# EAGLE design untitled (EAGLE 6.5.0)
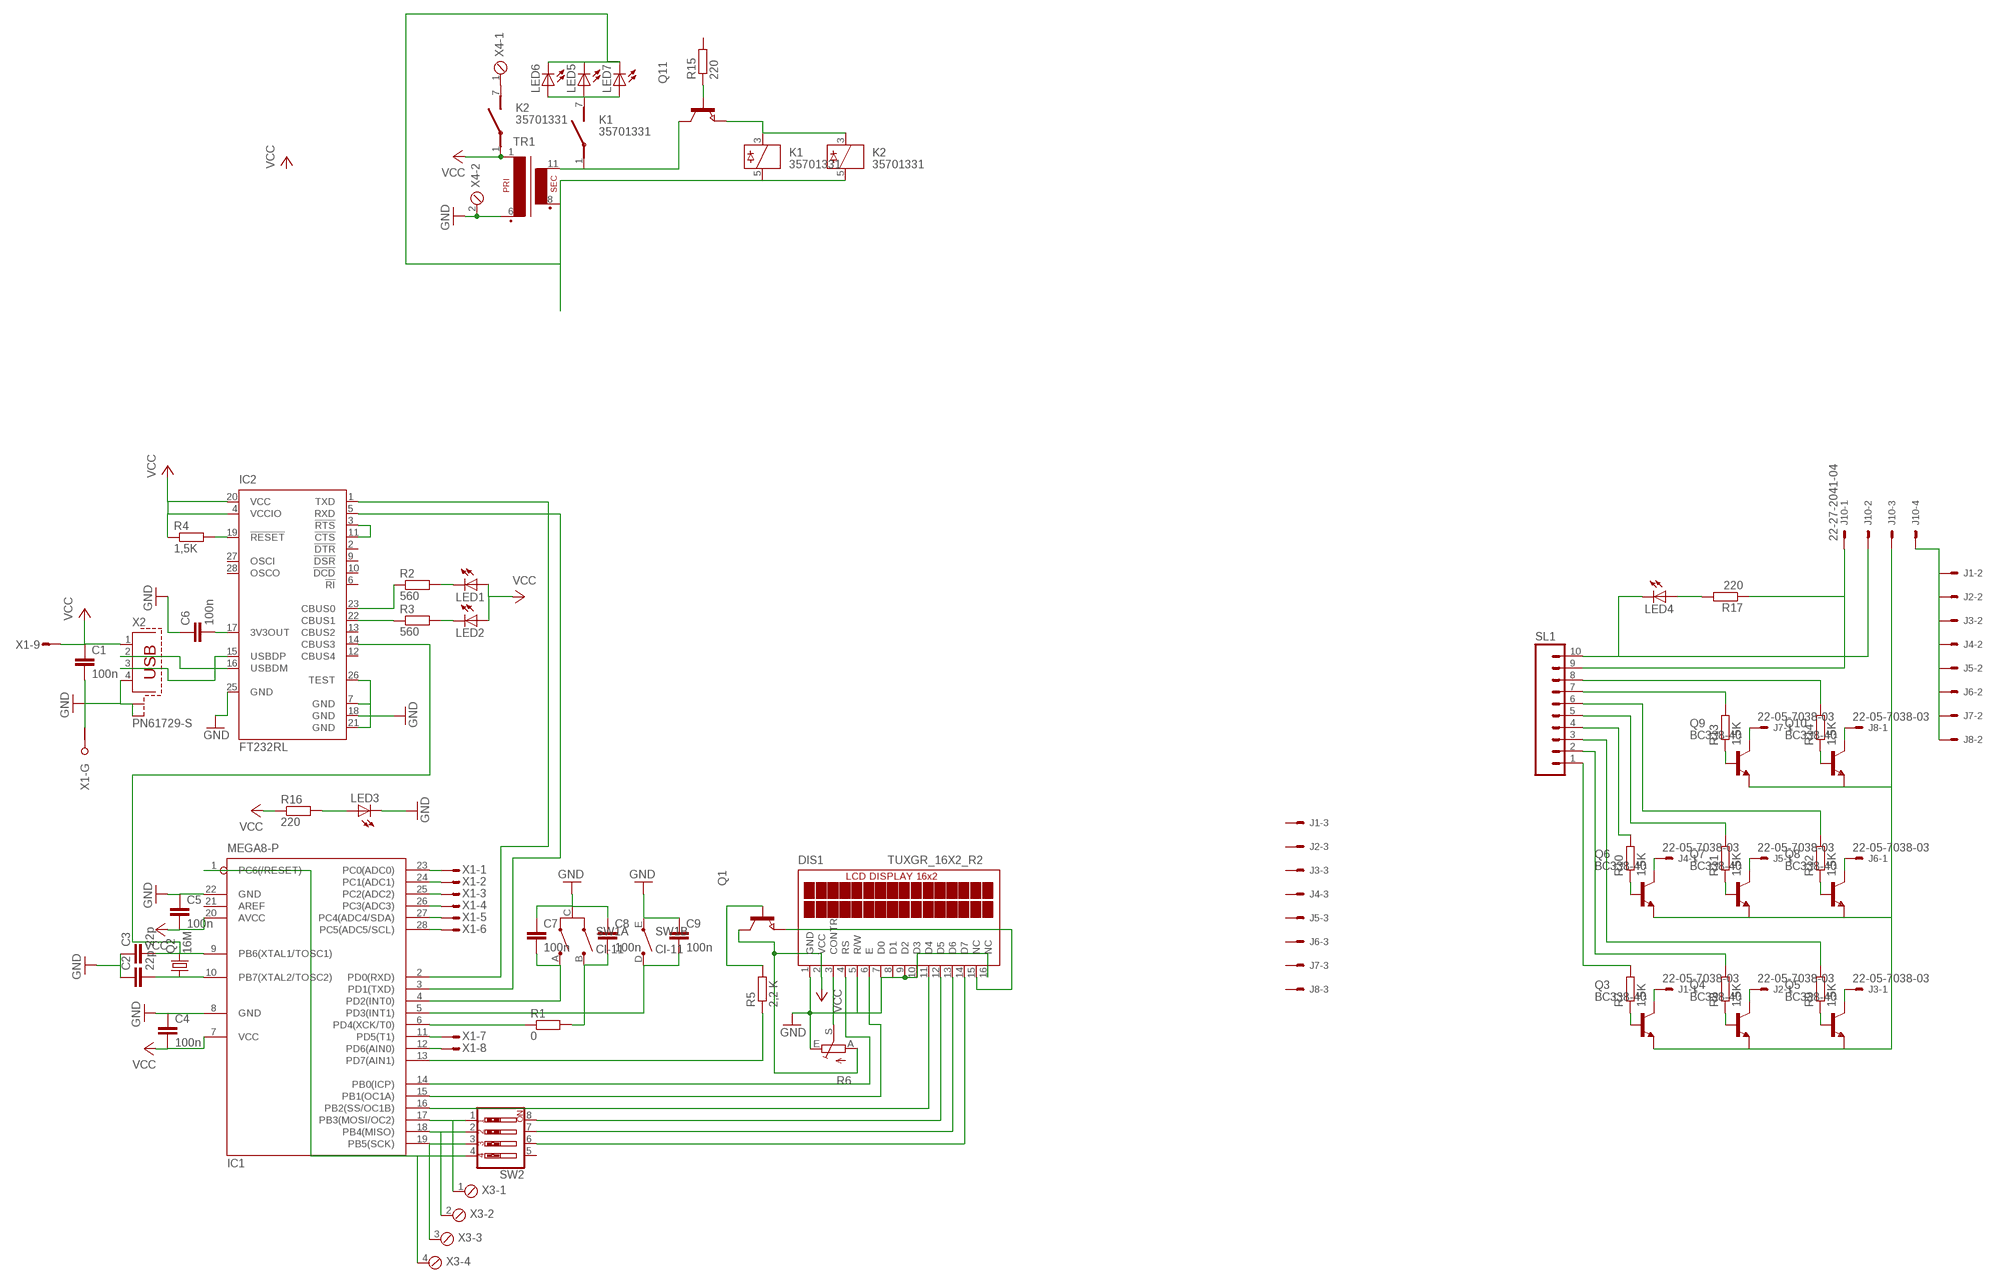
[diagram p0: schematic, sheet 1]

## Parts
C1  100n  C-EUC0603  [C0603]
C2  22p  C-EU050-024X044  [C050-024X044]
C3  22p  C-EU050-024X044  [C050-024X044]
C4  100n  C-EUC0603  [C0603]
C5  100n  C-EUC0603  [C0603]
C6  100n  C-EUC0603  [C0603]
C7  100n  C-EU050-024X044  [C050-024X044]
C8  100n  C-EU050-024X044  [C050-024X044]
C9  100n  C-EU050-024X044  [C050-024X044]
DIS1  TUXGR_16X2_R2  [TUXGR_16X2_R2]
IC1  MEGA8-P  [DIL28-3]
IC2  FT232RL  [SSOP28]
J1  22-05-7038-03  [7395-03]
J2  22-05-7038-03  [7395-03]
J3  22-05-7038-03  [7395-03]
J4  22-05-7038-03  [7395-03]
J5  22-05-7038-03  [7395-03]
J6  22-05-7038-03  [7395-03]
J7  22-05-7038-03  [7395-03]
J8  22-05-7038-03  [7395-03]
J10  22-27-2041-04  [6410-04]
K1  35701331  [REED]
K2  35701331  [REED]
LED1  LEDCHIPLED_0805  [CHIPLED_0805]
LED2  LEDCHIPLED_0805  [CHIPLED_0805]
LED3  LED5MM  [LED5MM]
LED4  LED5MM  [LED5MM]
LED5  LED5MM  [LED5MM]
LED6  LED5MM  [LED5MM]
LED7  LED5MM  [LED5MM]
Q1  NPN-TRANSISTOR_SOT23  [SOT23]
Q2  16M  CRYSTALHC49U-V  [HC49U-V]
Q3  BC338-40  [TO92-EBC]
Q4  BC338-40  [TO92-EBC]
Q5  BC338-40  [TO92-EBC]
Q6  BC338-40  [TO92-EBC]
Q7  BC338-40  [TO92-EBC]
Q8  BC338-40  [TO92-EBC]
Q9  BC338-40  [TO92-EBC]
Q10  BC338-40  [TO92-EBC]
Q11  NPN-TRANSISTOR_SOT23  [SOT23]
R1  0  R-EU_M1206  [M1206]
R2  560  R-EU_M1406  [M1406]
R3  560  R-EU_M1406  [M1406]
R4  1,5K  R-EU_0204/5  [0204/5]
R5  2,2 K  R-EU_0204/7  [0204/7]
R6  TRIM_EU-CA6V  [CA6V]
R7  1,5K  R-EU_0204/5  [0204/5]
R8  1,5K  R-EU_0204/5  [0204/5]
R9  1,5K  R-EU_0204/5  [0204/5]
R10  1,5K  R-EU_0204/5  [0204/5]
R11  1,5K  R-EU_0204/5  [0204/5]
R12  1,5K  R-EU_0204/5  [0204/5]
R13  1,5K  R-EU_0204/5  [0204/5]
R14  1,5K  R-EU_0204/5  [0204/5]
R15  220  R-EU_0204/7  [0204/7]
R16  220  R-EU_0204/7  [0204/7]
R17  220  R-EU_0204/7  [0204/7]
SL1  M10  [10P]
SW1  CI-11  [CI-11]
SW2  SW_DIP-4  [EDG-04]
TR1  EI48-1  [EI48-1]
X1  M09VPS  [M09VP]
X2  PN61729-S  [PN61729-S]
X3  MPT4  [4POL254]
X4  MPT4  [4POL254]

## Nets
GND: C1.2 C2.1 C3.1 C4.1 C5.1 C6.1 C7.1 C8.1 C9.1 DIS1.1(GND) DIS1.5(R/W) DIS1.7(D0) DIS1.8(D1) DIS1.9(D2) DIS1.10(D3) DIS1.16(NC) IC1.8(GND) IC1.22(GND) IC2.7(GND) IC2.18(GND) IC2.21(GND) IC2.25(GND) IC2.26(TEST) LED3.K(C) R6.E SW1.C(A:C) SW1.E(B:E) TR1.6(P2) X1.G1(-G:G1) X2.4 X2.S1 X2.S2 X4.2
N$2: IC1.11(PD5(T1)) X1.7(-7:M)
N$3: IC1.6(PD4(XCK/T0)) R1.1
N$4: LED5.K(C) LED6.K(C) LED7.K(C)
N$5: Q11.1(B) R15.1
N$6: K1.1(2:P) Q11.3(C) TR1.11(S4)
N$7: K1.3 K2.3 Q11.2(E)
N$8: K1.5 K2.5 TR1.8(S3)
N$11: IC2.16(USBDM) X2.2
N$12: IC2.15(USBDP) X2.3
N$13: DIS1.3(CONTR) R6.S
N$14: DIS1.4(RS) IC1.14(PB0(ICP))
N$15: DIS1.6(E) IC1.15(PB1(OC1A))
N$16: DIS1.11(D4) IC1.16(PB2(SS/OC1B))
N$17: DIS1.12(D5) SW2.8
N$18: DIS1.13(D6) SW2.7
N$19: DIS1.14(D7) SW2.6
N$20: IC1.13(PD7(AIN1)) R5.1
N$21: Q1.1(B) R5.2
N$22: DIS1.15(NC) Q1.2(E)
N$23: C3.2 IC1.9(PB6(XTAL1/TOSC1)) IC2.14(CBUS3) Q2.2
N$24: C6.2 IC2.17(3V3OUT)
N$25: C2.2 IC1.10(PB7(XTAL2/TOSC2)) Q2.1
N$26: LED1.C R2.2
N$27: LED2.C R3.2
N$28: IC2.19(!RESET) R4.2
N$29: IC2.23(CBUS0) R2.1
N$30: IC2.22(CBUS1) R3.1
N$31: IC2.3(!RTS) IC2.11(!CTS)
N$32: IC1.2(PD0(RXD)) IC2.1(TXD)
N$33: IC1.3(PD1(TXD)) IC2.5(RXD)
N$34: IC1.1(PC6(/RESET)) SW2.4 X3.4
N$35: IC1.23(PC0(ADC0)) X1.1(-1:M)
N$36: IC1.24(PC1(ADC1)) X1.2(-2:M)
N$37: IC1.25(PC2(ADC2)) X1.3(-3:M)
N$38: IC1.26(PC3(ADC3)) X1.4(-4:M)
N$39: IC1.27(PC4(ADC4/SDA)) X1.5(-5:M)
N$40: IC1.28(PC5(ADC5/SCL)) X1.6(-6:M)
N$41: IC1.12(PD6(AIN0)) X1.8(-8:M)
N$42: IC1.17(PB3(MOSI/OC2)) SW2.1 X3.1
N$43: IC1.18(PB4(MISO)) SW2.2 X3.2
N$44: IC1.19(PB5(SCK)) SW2.3 X3.3
N$45: K1.7(2:S) LED5.A LED6.A LED7.A
N$46: C9.2 IC1.5(PD3(INT1)) SW1.D(B:D)
N$47: C7.2 IC1.4(PD2(INT0)) SW1.A(A:A)
N$48: C8.2 R1.2 SW1.B(A:B)
N$49: J1.1 Q3.C
N$50: J2.1 Q4.C
N$51: K2.7(2:S) X4.1
N$52: LED3.A R16.2
N$53: J10.1 R17.1 SL1.9
N$54: LED4.A R17.2
N$55: J10.2 LED4.K(C) SL1.10
N$56: J3.1 Q5.C
N$57: J6.1 Q8.C
N$58: J5.1 Q7.C
N$59: J4.1 Q6.C
N$60: J7.1 Q9.C
N$61: J8.1 Q10.C
N$62: R7.2 SL1.1
N$63: Q3.B R7.1
N$64: R8.2 SL1.2
N$65: Q4.B R8.1
N$66: R9.2 SL1.3
N$70: R10.2 SL1.4
N$71: R11.2 SL1.5
N$72: R12.2 SL1.6
N$73: R13.2 SL1.7
N$74: R14.2 SL1.8
N$75: Q9.B R13.1
N$76: Q10.B R14.1
N$77: Q8.B R12.1
N$78: Q7.B R11.1
N$79: Q6.B R10.1
N$80: Q5.B R9.1
N$81: J1.2 J2.2 J3.2 J4.2 J5.2 J6.2 J7.2 J8.2 J10.4
N$82: J10.3 Q3.E Q4.E Q5.E Q6.E Q7.E Q8.E Q9.E Q10.E
VCC: C1.1 C4.2 C5.2 DIS1.2(VCC) IC1.7(VCC) IC1.20(AVCC) IC2.4(VCCIO) IC2.20(VCC) K2.1(2:P) LED1.A LED2.A Q1.3(C) R4.1 R6.A R16.1 TR1.1 X1.9(-9:M) X2.1
Unconnected: IC1.21(AREF) IC2.2(!DTR) IC2.6(!RI) IC2.9(!DSR) IC2.10(!DCD) IC2.12(CBUS4) IC2.13(CBUS2) IC2.27(OSCI) IC2.28(OSCO) J1.3 J2.3 J3.3 J4.3 J5.3 J6.3 J7.3 J8.3 R15.2 SW2.5 X1.G2(-G:G2) X4.3 X4.4

## Library data of the parts
C1-C9 = rcl:C-EU: CAPACITOR, European symbol
DIS1 = display-lcd:TUXGR_16X2_R2: Tuxgraphics LCD display 16x2 characters reflective, without background light Source: tuxgr_12x2_r2.pdf; OC_FARNELL: unknown; OC_NEWARK: unknown
IC1 = atmel:MEGA8-P: MICROCONTROLLER 8 Kbytes FLASH, 1 kbytes SRAM, 512 bytes EEPROM, USART, 4-channel 10 bit ADC, 2-channel 8 bit ADC Pin compatible with Atmega48, ATMega88, ATMega168 Source: avr.lbr; OC_FARNELL: unknown; OC_NEWARK: unknown
IC2 = ftdichip:FT232R: Source: http://www.ftdichip.com/Documents/DataSheets/DS_FT232R_v104.pdf; MPN: FT232RL; OC_FARNELL: 1146032; OC_NEWARK: 91K9918
J1-J8 = con-molex:22-?-03: CONNECTOR wire to board 2.54 mm (.1 inch) pitch header; OC_FARNELL: unknown; OC_NEWARK: unknown
J10 = con-molex:22-?-04: CONNECTOR wire to board 2.54 mm (.1 inch) pitch header; OC_FARNELL: unknown; OC_NEWARK: unknown
K1 K2 = relay:35701331: RELAY reed, 1 x norm. open with polarity; OC_FARNELL: unknown; OC_NEWARK: unknown
LED1-LED7 = led:LED: LED OSRAM: - CHIPLED LG R971, LG N971, LY N971, LG Q971, LY Q971, LO R971, LY R971 LH N974, LH R974 LS Q976, LO Q976, LY Q976 LO Q996 - Hyper CHIPLED LW Q18S LB Q993, LB Q99A, LB R99A - SideLED LS A670, LO A670, LY A670, LG A670, LP A670 LB A673, LV A673, LT A673, LW A673 LH A674 LY A675 LS A676, LA A676, LO A676, LY A676, LW A676 LS A679, LY A679, LG A679 - Hyper Micro SIDELED® LS Y876, LA Y876, LO Y876, LY Y876 LT Y87S - SmartLED LW L88C, LW L88S LB L89C, LB L89S, LG L890 LS L89K, LO L89K, LY L89K LS L896, LA L896, LO L896, LY L896 - TOPLED LS T670, LO T670, LY T670, LG T670, LP T670 LSG T670, LSP T670, LSY T670, LOP T670, LYG T670 LG T671, LOG T671, LSG T671 LB T673, LV T673, LT T673, LW T673 LH T674 LS T676, LA T676, LO T676, LY T676, LB T676, LH T676, LSB T676, LW T676 LB T67C, LV T67C, LT T67C, LS T67K, LO T67K, LY T67K, LW E67C LS E67B, LA E67B, LO E67B, LY E67B, LB E67C, LV E67C, LT E67C LW T67C LS T679, LY T679, LG T679 LS T770, LO T770, LY T770, LG T770, LP T770 LB T773, LV T773, LT T773, LW T773 LH T774 LS E675, LA E675, LY E675, LS T675 LS T776, LA T776, LO T776, LY T776, LB T776 LHGB T686 LT T68C, LB T68C - Hyper Mini TOPLED® LB M676 - Mini TOPLED Santana® LG M470 LS M47K, LO M47K, LY M47K Source: http://www.osram.convergy.de LUXEON: - LUMILED® LXK2-PW12-R00, LXK2-PW12-S00, LXK2-PW14-U00, LXK2-PW14-V00 LXK2-PM12-R00, LXK2-PM12-S00, LXK2-PM14-U00 LXK2-PE12-Q00, LXK2-PE12-R00, LXK2-PE12-S00, LXK2-PE14-T00, LXK2-PE14-U00 LXK2-PB12-K00, LXK2-PB12-L00, LXK2-PB12-M00, LXK2-PB14-N00, LXK2-PB14-P00, LXK2-PB14-Q00 LXK2-PR12-L00, LXK2-PR12-M00, LXK2-PR14-Q00, LXK2-PR14-R00 LXK2-PD12-Q00, LXK2-PD12-R00, LXK2-PD12-S00 LXK2-PH12-R00, LXK2-PH12-S00 LXK2-PL12-P00, LXK2-PL12-Q00, LXK2-PL12-R00 Source: www.luxeon.com KINGBRIGHT: KA-3528ASYC Source: www.kingbright.com
Q1 Q11 = semicon-smd-ipc:NPN-TRANSISTOR_: NPN TRANSISTOR
Q2 = crystal:CRYSTAL: CRYSTAL; OC_FARNELL: 1666969; OC_NEWARK: unknown
Q3-Q10 = transistor-npn:BC338*: NPN Transistor
R1-R5 R7-R17 = resistor:R-EU_: RESISTOR, European symbol
R6 = pot:TRIM_EU-: POTENTIOMETER
SL1 = con-amp-quick:M10: AMP QUICK CONNECTOR; OC_FARNELL: unknown; OC_NEWARK: unknown
SW1 = piher:CI-11: 11mm Incemental Encoder Source: www.piher.net .. 04-CI-11v04.pdf; OC_FARNELL: unknown; OC_NEWARK: unknown
SW2 = special:SW_DIP-4: DIP SWITCH
TR1 = trafo:EI48-1: TRANSFORMER 1 primary winding, 1 secondary winding ERA
X1 = con-subd:M09VPS: SUB-D; OC_FARNELL: unknown; OC_NEWARK: unknown
X2 = con-berg:PN61729-S: BERG USB connector; OC_FARNELL: unknown; OC_NEWARK: unknown
X3 X4 = con-phoenix-254:MPT4: PHOENIX CONNECTOR; OC_FARNELL: unknown; OC_NEWARK: unknown

## Board
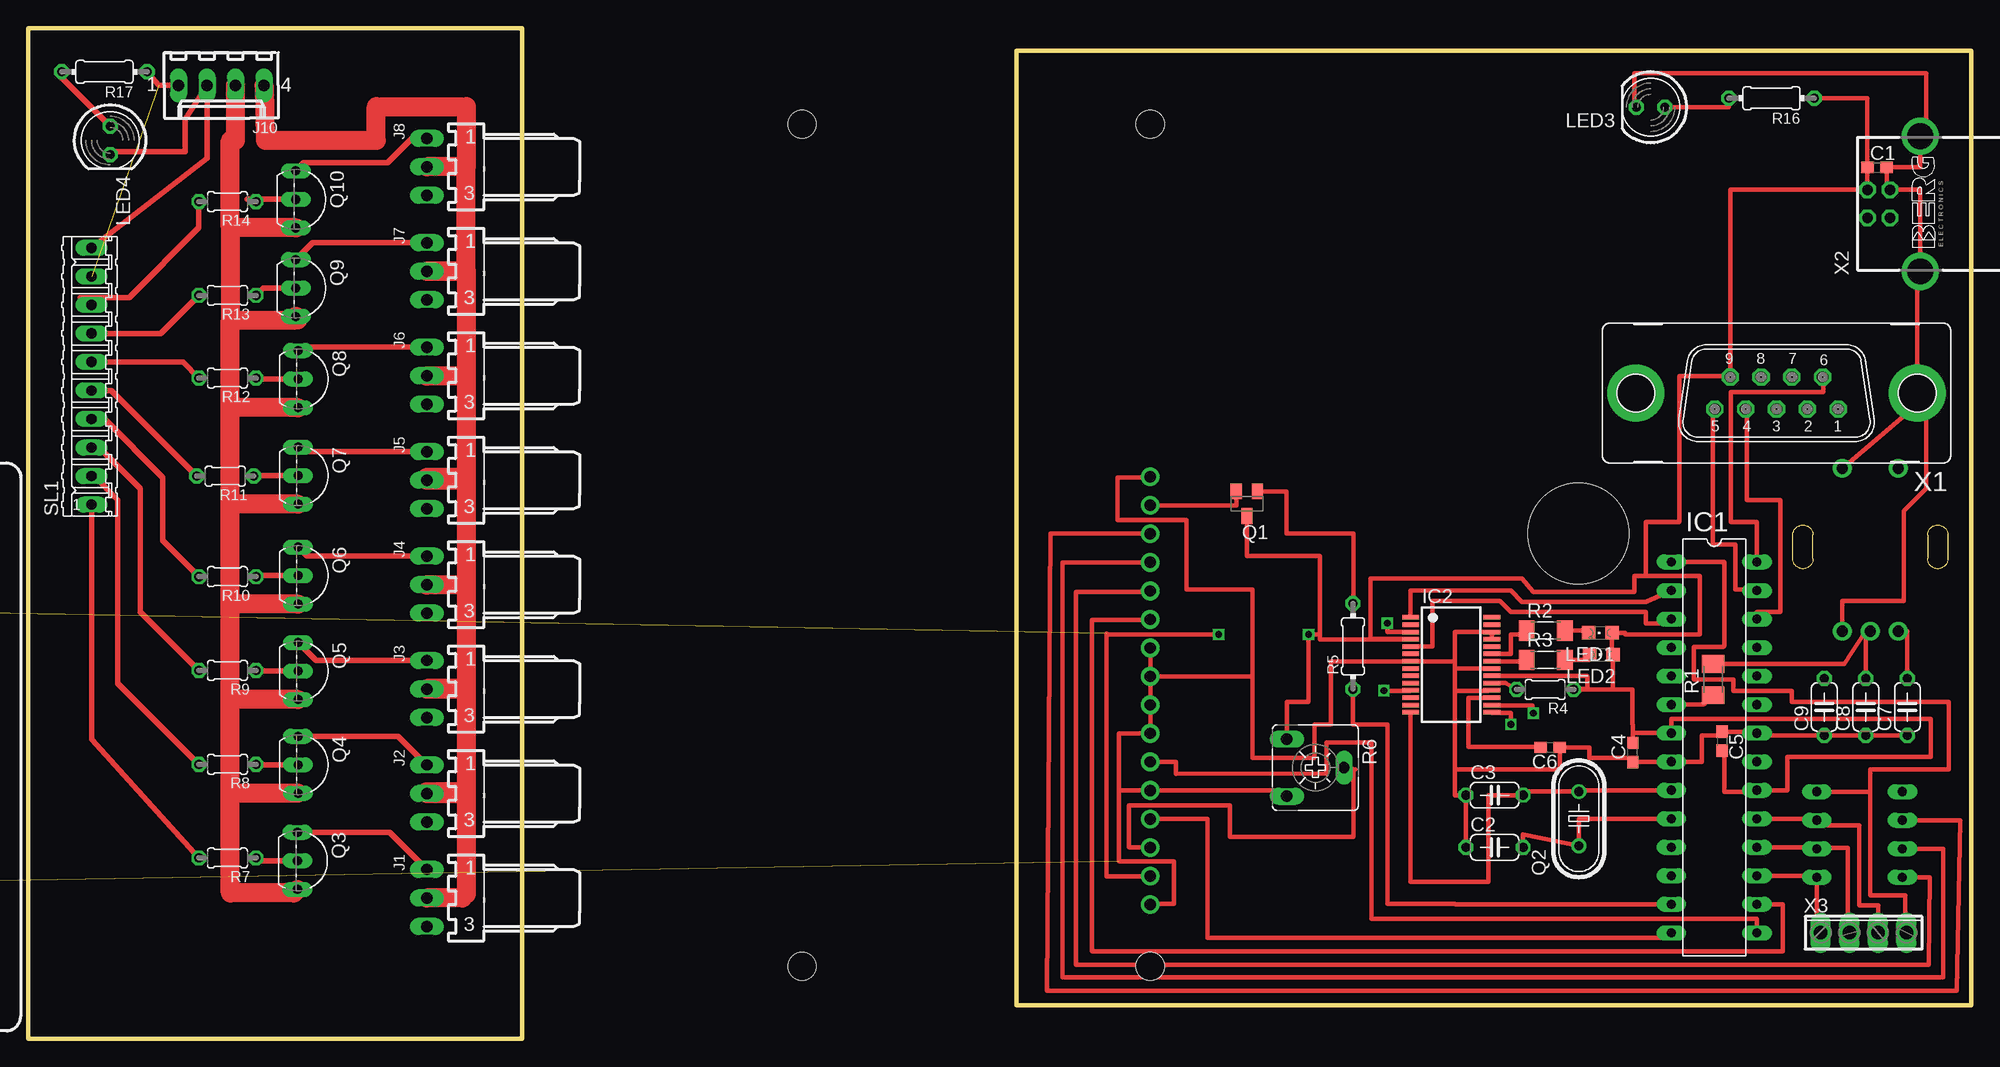
[diagram p1: board, top side]
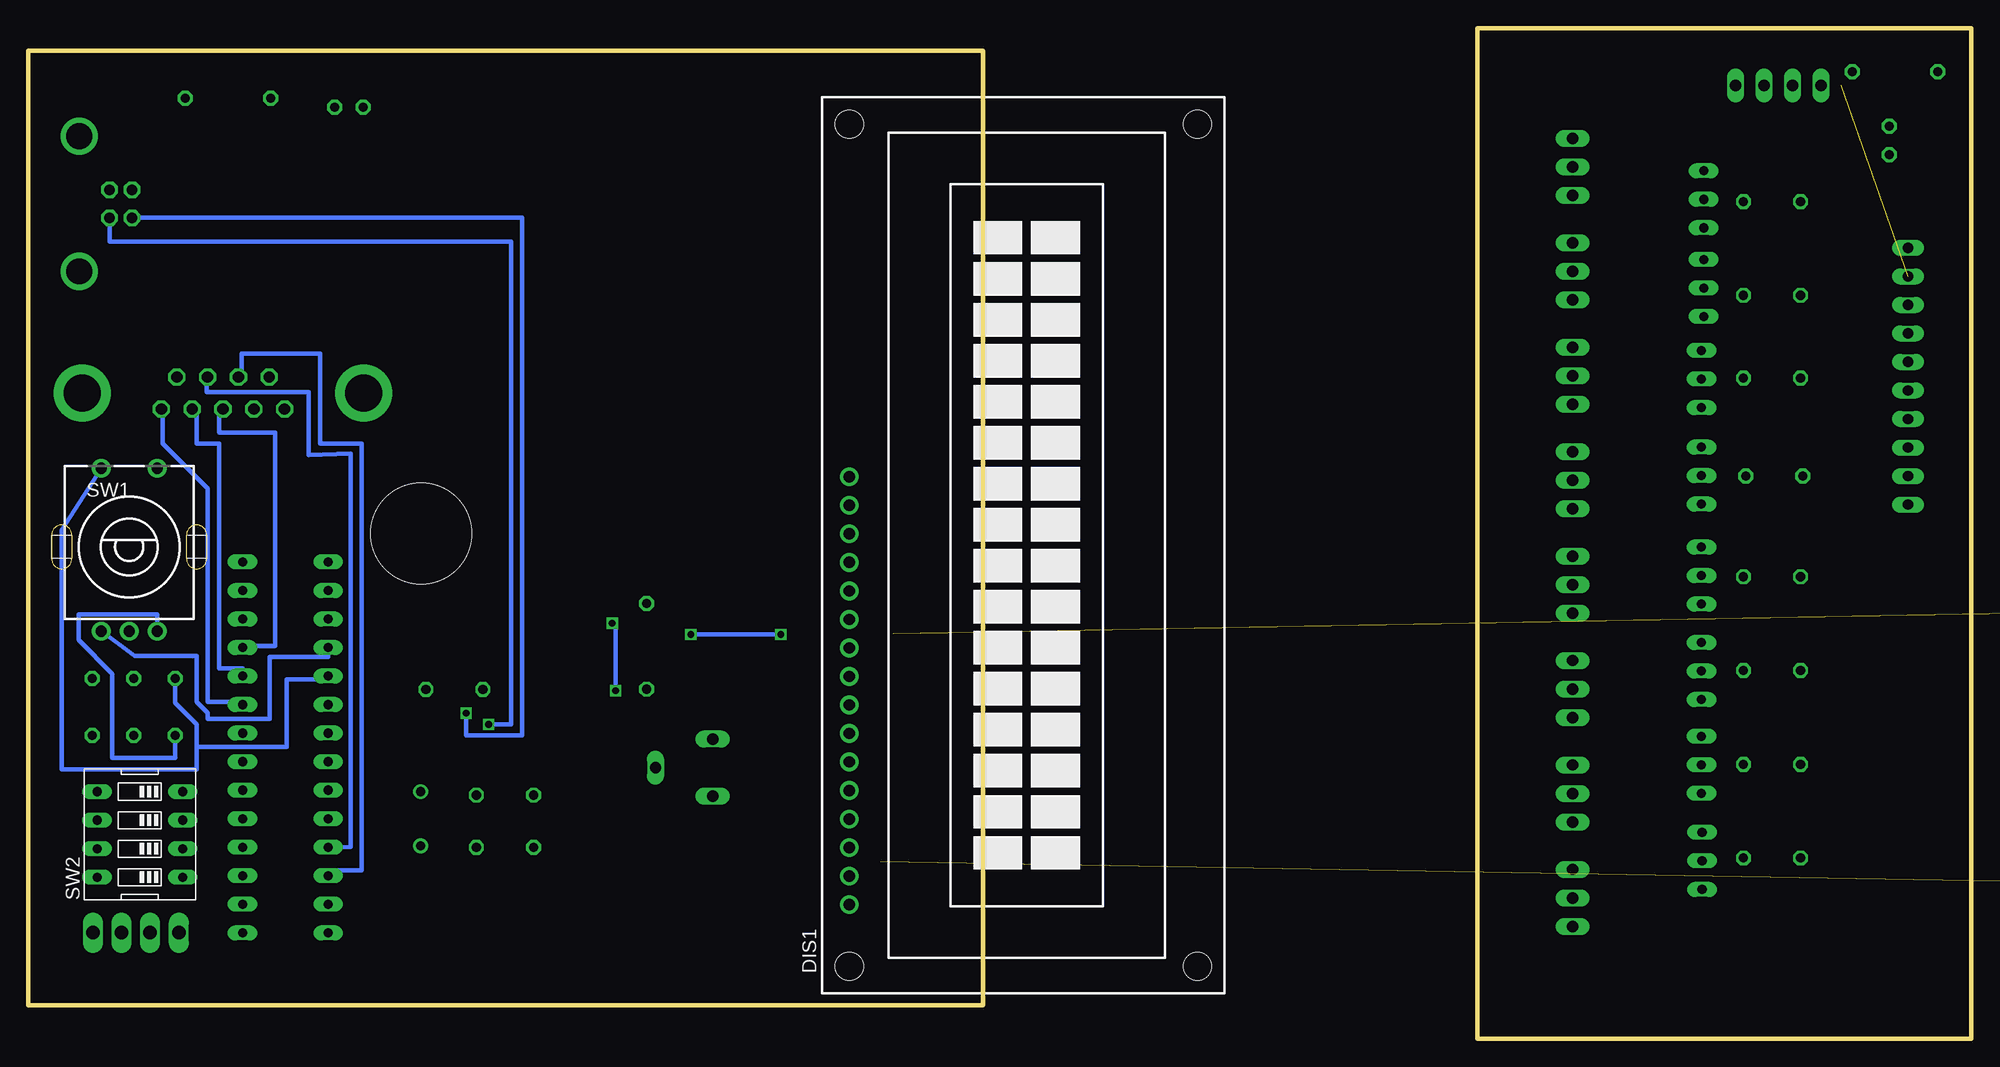
[diagram p2: board, bottom side, seen from below]

Size 173 x 90 mm. Coordinates in mm from the lower left corner, seen from the top.
Outline: 88,88 173,88 173,3 88,3 88,88
Outline: 0,90 44,90 44,0 0,0 0,90
Copper layers (1*16): Top 0.035mm / dielectric 1.5mm / Bottom 0.035mm
Design rules "default": minimum track width 10mil, minimum drill 24mil, track to track 8mil, track to pad 8mil, pad to pad 8mil, via to via 8mil, smd to smd 8mil, copper to edge 40mil, drill to drill 8mil, minimum pad ring 10mil, minimum via ring 8mil, stop-mask expansion 4mil, vias tented up to drill 0mil, thermal gap 10mil
Holes 9 mm at 138,45

### Footprints (pad centres in the part's own frame; a part is rotated, then mirrored left to right if it is on the bottom)
C0603 = smd 1.1 x 1: 1 -0.85,0; 2 0.85,0
C050-024X044 = drill 0.813 octagon: 1 -2.54,0; 2 2.54,0
TUXGR_16X2_R2 = drill 1 pad 1.676: 1 -32,15.5; 2 -29.46,15.5; 3 -26.92,15.5; 4 -24.38,15.5; 5 -21.84,15.5; 6 -19.3,15.5; 7 -16.76,15.5; 8 -14.22,15.5; 9 -11.68,15.5; 10 -9.14,15.5; 11 -6.6,15.5; 12 -4.06,15.5; 13 -1.52,15.5; 14 1.02,15.5; 15 3.56,15.5; 16 6.1,15.5 | hole 2.5: -37.5,-15.5; 37.5,-15.5; -37.5,15.5; 37.5,15.5
DIL28-3 = drill 0.813 long: 1 -16.51,-3.81; 2 -13.97,-3.81; 3 -11.43,-3.81; 4 -8.89,-3.81; 5 -6.35,-3.81; 6 -3.81,-3.81; 7 -1.27,-3.81; 8 1.27,-3.81; 9 3.81,-3.81; 10 6.35,-3.81; 11 8.89,-3.81; 12 11.43,-3.81; 13 13.97,-3.81; 14 16.51,-3.81; 15 16.51,3.81; 16 13.97,3.81; 17 11.43,3.81; 18 8.89,3.81; 19 6.35,3.81; 20 3.81,3.81; 21 1.27,3.81; 22 -1.27,3.81; 23 -3.81,3.81; 24 -6.35,3.81; 25 -8.89,3.81; 26 -11.43,3.81; 27 -13.97,3.81; 28 -16.51,3.81
SSOP28 = smd 0.4 x 1.5: 1 -4.225,-3.625; 2 -3.575,-3.625; 3 -2.925,-3.625; 4 -2.275,-3.625; 5 -1.625,-3.625; 6 -0.975,-3.625; 7 -0.325,-3.625; 8 0.325,-3.625; 9 0.975,-3.625; 10 1.625,-3.625; 11 2.275,-3.625; 12 2.925,-3.625; 13 3.575,-3.625; 14 4.225,-3.625; 15 4.225,3.625; 16 3.575,3.625; 17 2.925,3.625; 18 2.275,3.625; 19 1.625,3.625; 20 0.975,3.625; 21 0.325,3.625; 22 -0.325,3.625; 23 -0.975,3.625; 24 -1.625,3.625; 25 -2.275,3.625; 26 -2.925,3.625; 27 -3.575,3.625; 28 -4.225,3.625
7395-03 = drill 1.016 long: 1 2.54,0; 2 0,0; 3 -2.54,0
6410-04 = drill 1.016 long: 1 3.81,0; 2 1.27,0; 3 -1.27,0; 4 -3.81,0
REED = drill 0.813 long: 1 -17.78,2.54; 3 -12.7,2.54; 5 -7.62,2.54; 7 -2.54,2.54
CHIPLED_0805 = smd 1.2 x 1.2: A 0,-1.05; C 0,1.05
LED5MM = drill 0.813 octagon: A -1.27,0; K 1.27,0
SOT23 = smd 1 x 1.4: 1 -0.95,-1.1; 2 0.95,-1.1; 3 0,1.1
HC49U-V = drill 0.813: 1 -2.413,0; 2 2.413,0
TO92-EBC = drill 0.813 long: B 0,-1.27; C -2.54,-1.27; E 2.54,-1.27
M1206 = smd 1.6 x 2: 1 -1.4,0; 2 1.4,0
M1406 = smd 1.4 x 1.8: 1 -1.7,0; 2 1.7,0
0204/5 = drill 0.813 octagon: 1 -2.54,0; 2 2.54,0
0204/7 = drill 0.813 octagon: 1 -3.81,0; 2 3.81,0
CA6V = drill 1.016 long: A -2.54,-2.54; E 2.54,-2.54; S 0,2.54
10P = drill 0.914 long: 1 -11.43,0; 2 -8.89,0; 3 -6.35,0; 4 -3.81,0; 5 -1.27,0; 6 1.27,0; 7 3.81,0; 8 6.35,0; 9 8.89,0; 10 11.43,0
CI-11 = drill 1 pad 1.676: A -2.5,-7.5; B 0,-7.5; C 2.5,-7.5; D -2.5,7; E 2.5,7
EDG-04 = drill 0.813 long: 1 -3.81,-3.81; 2 -1.27,-3.81; 3 1.27,-3.81; 4 3.81,-3.81; 5 3.81,3.81; 6 1.27,3.81; 7 -1.27,3.81; 8 -3.81,3.81
EI48-1 = drill 1.194 pad 5.08 octagon: 1 -13.767,12.497; 6 -13.767,-12.497 | drill 1.194 pad 3.81 octagon: 7 13.767,-12.497; 8 13.767,-7.493; 11 13.767,7.493; 12 13.767,12.497
M09VP = drill 1.016 octagon: 1 -5.486,1.422; 2 -2.743,1.422; 3 0,1.422; 4 2.743,1.422; 5 5.486,1.422; 6 -4.115,-1.422; 7 -1.372,-1.422; 8 1.372,-1.422; 9 4.115,-1.422 | drill 3.302 pad 5.08: G1 -12.522,0; G2 12.522,0
PN61729-S = drill 0.95 octagon: 1 1.25,4.71; 2 -1.25,4.71; 3 -1.25,2.71; 4 1.25,2.71 | drill 2.3 pad 2.9: S1 -6.02,0; S2 6.02,0
4POL254 = drill 1.2 long: 1 -3.81,0; 2 -1.27,0; 3 1.27,0; 4 3.81,0

### Placement (x,y rotation side)
C1  164.6,77.6 0 top
C2  130.55,17.05 0 top
C3  130.55,21.7 0 top
C4  142.85,25.5 90 top
C5  150.8,26.5 270 top
C6  135.5,25.95 180 top
C7  167.3,29.55 90 top
C8  163.6,29.55 90 top
C9  159.9,29.55 90 top
DIS1  84.4,43.95 90 bottom
IC1  150.1,25.95 270 top
IC2  126.7,33.3 270 top
J1  35.5,12.55 90 top
J2  35.5,21.85 90 top
J3  35.5,31.15 90 top
J4  35.5,40.45 90 top
J5  35.5,49.75 90 top
J6  35.5,59.05 90 top
J7  35.5,68.35 90 top
J8  35.5,77.65 90 top
J10  17.2,84.9 180 top
K1  -23,-8 0 top  (outside the outline)
K2  -23,-17 0 top  (outside the outline)
LED1  139.95,36.15 90 top
LED2  140.05,34.2 90 top
LED3  144.45,82.95 180 top
LED4  7.3,80 270 top
LED5  -41,-22 0 top  (outside the outline)
LED6  -41,-39 0 top  (outside the outline)
LED7  -41,-46 0 top  (outside the outline)
Q1  108.5,47.65 180 top
Q2  138.05,19.6 90 top
Q3  25.25,15.85 270 top
Q4  25.3,24.4 270 top
Q5  25.3,32.75 270 top
Q6  25.3,41.25 270 top
Q7  25.3,50.15 270 top
Q8  25.3,58.75 270 top
Q9  25.1,66.85 270 top
Q10  25.1,74.75 270 top
Q11  -42,-33 0 top  (outside the outline)
R1  150,32 90 top
R2  135.1,36.35 0 top
R3  135.1,33.75 0 top
R4  135.05,31.1 180 top
R5  117.95,34.95 90 top
R6  114.6,24.15 270 top
R7  17.75,16.1 180 top
R8  17.75,24.45 180 top
R9  17.75,32.8 180 top
R10  17.75,41.15 180 top
R11  17.55,50.1 180 top
R12  17.75,58.85 180 top
R13  17.75,66.2 180 top
R14  17.75,74.55 180 top
R15  -39,-28 0 top  (outside the outline)
R16  155.2,83.75 180 top
R17  6.8,86.1 180 top
SL1  5.65,59 90 top
SW1  164,43.8 0 bottom
SW2  163.05,18.2 90 bottom
TR1  -22,26 0 top  (outside the outline)
X1  155.65,57.5 180 top
X2  168.45,74.35 90 top
X3  163.4,9.45 0 top
X4  -38,-53 0 top  (outside the outline)

### Tracks (layer width: path | path; a pad name or v marks a point on that pad's centre or on a via)
GND  (2 unrouted)
  Top 0.406: 127,33.62 127,36.23 IC2.26 IC2.25 | 127,33 130.32,33 IC2.21 | 127,33 127,31 | 127,31 130,31 130,31.02 IC2.18 | 127,33 127,33.62 | 127,33.62 IC2.7 116,33.62 116,28 114.5,28 114.5,25 109,25 109,32.27 | DIS1.1 99.9,12 102,12 102,15.8 97.1,15.8 97.1,22.11 | 97.1,22.11 DIS1.5 113.06,22.11 R6.E | 97.1,22.11 97.1,27.19 DIS1.7 DIS1.8 DIS1.9 | DIS1.9 DIS1.10 | DIS1.16 99.9,50 97,50 97,46.2 103.1,46.2 103.1,40 109,40 109,32.27 | 109,32.27 DIS1.9 | C7.1 C8.1 C9.1 153.91,27.01 IC1.22 153.91,27.35 C5.1 150.8,27 149,27 149,24.68 IC1.8 146.29,24.65 C4.1 142.85,25 139,25 139,25.95 C6.1 136.35,24 127,24 | C2.1 C3.1 127,21.7 127,24 | 127,24 127,31 | LED3.K 143.18,83 143,83 143,86 169,86 169,80.37 X2.S2 168.45,77.6 C1.2 165.45,75.6 X2.4 168.45,75.6 X2.S1 168.17,68.33 X1.G1 168.17,57 | 168.17,57 168.17,56.47 SW1.E | SW1.C 161.5,39 167,39 167,47 169,49 169,57 168.17,57
  Bottom 0.406: C9.1 159.9,25 165.5,25 165.5,32.5 168.5,35.5 168.5,37.8 161.5,37.8 SW1.C
N$2
  Bottom 0.406: IC1.11 146.29,17 144.3,17.1 144.3,52.1 148,52 148,57.6 157.1,57.6 157.1,58.92 X1.7
N$3
  Top 0.406: R1.1 149.16,29.76 IC1.6
N$4  (2 unrouted)
N$5  (1 unrouted)
N$6  (2 unrouted)
N$7  (2 unrouted)
N$8  (2 unrouted)
N$11  (via drill 0.6)
  Top 0.406: IC2.16 130.32,29.7 133.9,29.7 133.9,29 v134,29
  Bottom 0.406: v134,29 134,27 129,27 129,73.1 X2.2
N$12  (via drill 0.6)
  Top 0.406: IC2.15 130.32,29 132,29 v132,28
  Bottom 0.406: v132,28 130,28 130,71 165.74,71 X2.3
N$13
  Top 0.406: R6.S 118.14,24 118,24 118,18 107,18 107,20.8 98,20.8 98,17.03 DIS1.3
N$14
  Top 0.406: IC1.14 145.85,9 105,9 105,19.57 DIS1.4
N$15
  Top 0.406: DIS1.6 102.2,24.65 102.2,23.6 115.6,23.65 | 115.6,23.65 115.6,23.6 | 115.6,23.65 115.6,26.4 119.6,26.4 119.6,10.7 153.9,10.7 153.91,9.49 IC1.15
N$16
  Top 0.406: DIS1.11 99.9,37.3 94.7,37.3 94.7,7.8 156.2,7.8 156.2,11.98 IC1.16
N$17
  Top 0.406: DIS1.12 99.9,39.8 93.3,39.8 93.3,6.6 169.2,6.6 169.3,14.39 SW2.8
N$18
  Top 0.406: DIS1.13 99.9,42.4 92.1,42.4 92.1,5.5 170.5,5.5 170.5,16.93 SW2.7
N$19
  Top 0.406: DIS1.14 99.9,45 91,45 90.7,4.3 171.7,4.3 172,19.47 SW2.6
N$20
  Top 0.406: R5.1 117.95,28 121,28 121,12 127,12 127,11.98 IC1.13
N$21
  Top 0.406: R5.2 118,39 118,45 112,45 112,48.75 Q1.1
N$22
  Top 0.406: Q1.2 107.55,47.51 DIS1.15
N$23
  Top 0.406: IC2.14 123.08,14 130,14 130,21.7 C3.2 133.09,22.01 Q2.2 138.05,22.14 IC1.9
N$24
  Top 0.406: C6.2 134.65,26 128.2,26 128.2,30.38 IC2.17
N$25
  Top 0.406: C2.2 133.09,18.19 Q2.1 138.05,19.6 IC1.10
N$26
  Top 0.406: LED1.C 138.9,36.35 R2.2
N$27
  Top 0.406: LED2.C 139,33.75 R3.2
N$28
  Top 0.406: R4.2 131.51,31.68 IC2.19
N$29
  Top 0.406: R2.1 133.4,36 132,36 132,34.27 IC2.23
N$30
  Top 0.406: R3.1 133.4,33.62 IC2.22
N$31  (via drill 0.6)
  Top 0.406: IC2.11 123.08,31 v120.7,31 | v121,37 121,36.23 IC2.3
  Bottom 0.406: v120.7,31 120.7,37 v121,37
N$32
  Top 0.406: IC2.1 123.08,39.92 132,39.92 133,38.9 144,38.9 IC1.2
N$33
  Top 0.406: IC1.3 146.29,37 144,37 144,38 132,38 131,39 125,39 125,34.92 IC2.5
N$34
  Top 0.406: 164,22 164,12.8 167.1,12.8 167.1,9.45 X3.4 | SW2.4 164,22 | 164,22 164,24 171,24 171,30 157,30 157,31 151.8,31 151.8,32 148.3,32 148.3,34.9 150.9,34.9 151,35 151,42.46 IC1.1
N$35
  Bottom 0.406: IC1.23 153.91,30 157,30 157,49 161,53 161,56.08 X1.1
N$36
  Bottom 0.406: IC1.24 153.91,33 156,33 156,53 158,53 158,56.08 X1.2
N$37
  Bottom 0.406: IC1.25 153.91,35 151,35 151,54 156,54 156,56.08 X1.3
N$38
  Top 0.406: IC1.26 153.91,38 156,38 156,48 153,48 153,56.08 X1.4
N$39
  Top 0.406: IC1.27 153.91,40 152,40 152,44 150,44 150,56.08 X1.5
N$40
  Top 0.406: IC1.28 153.91,46 151.6,46 151.6,57.6 159.8,57.6 159.8,58.92 X1.6
N$41
  Bottom 0.406: IC1.12 146.29,15 143.3,15 143.3,53 147,53 147,61 154,61 154,58.92 X1.8
N$42
  Top 0.406: X3.1 159.24,9.45 SW2.1 159.24,14.52 IC1.17
N$43
  Top 0.406: X3.2 162,9.45 162,17 159.24,17 SW2.2 159.24,17.06 IC1.18
N$44
  Top 0.406: X3.3 164.7,9.45 164.7,11.9 163,11.9 163,19 159.24,19 SW2.3 159.24,19.6 IC1.19
N$45  (3 unrouted)
N$46
  Bottom 0.406: IC1.5 146.29,32 150,32 150,26 158,26 | 158,26 158,28 159.9,29.9 C9.2 | SW1.D 170,45.3 170,24 158,24 158,26
N$47
  Top 0.406: C7.2 167.3,36.3 SW1.A
  Bottom 0.406: IC1.4 146.29,34 151.5,34 151.5,28.5 157,28.5 157,29 158,30 158,34.1 163.5,34.1 SW1.A | 167.4,32.09 C7.2
N$48
  Top 0.406: C8.2 163.6,36.3 | 163.6,36.3 SW1.B | 163.6,36.3 161.7,33.4 R1.2
N$49
  Top 0.5: J1.1 32.2,18.39 Q3.C
N$50
  Top 0.5: J2.1 32.95,26.94 Q4.C
N$51  (1 unrouted)
N$52
  Top 0.406: R16.2 151.39,82.95 LED3.A
N$53  (1 unrouted)
  Top 0.5: R17.1 11.61,84.9 J10.1
N$54
  Top 0.5: R17.2 2.99,85.58 LED4.A
N$55
  Top 0.5: SL1.10 15.93,78.43 J10.2 14,81.9 14,79 7.7,79 LED4.K
N$56
  Top 0.5: Q5.C 25.63,33.69 J3.1
N$57
  Top 0.5: Q8.C 24.33,61.59 J6.1
N$58
  Top 0.5: Q7.C 24.43,52.29 J5.1
N$59
  Top 0.5: Q6.C 24.83,42.99 J4.1
N$60
  Top 0.5: Q9.C 25.33,70.89 J7.1
N$61
  Top 0.5: Q10.C 24.54,78 32,78 34.19,80.19 J8.1
N$62
  Top 0.5: SL1.1 5.65,26.66 R7.2
N$63
  Top 0.5: R7.1 20.54,15.85 Q3.B
N$64
  Top 0.5: SL1.2 5.89,50.11 8,48 8,31.66 R8.2
N$65
  Top 0.5: R8.1 20.34,24.4 Q4.B
N$66
  Top 0.5: SL1.3 6.35,52.65 10,49 10,38.01 R9.2
N$70
  Top 0.5: SL1.4 6.81,55.19 12,50 12,44.36 R10.2
N$71
  Top 0.5: SL1.5 7.38,57.73 R11.2
N$72
  Top 0.5: SL1.6 13.79,60.27 R12.2
N$73
  Top 0.5: SL1.7 11.82,62.81 R13.2
N$74
  Top 0.5: SL1.8 4.65,66 9,66 15.21,72.21 R14.2
N$75
  Top 0.5: R13.1 20.94,66.85 Q9.B
N$76
  Top 0.5: R14.1 19.49,74.75 Q10.B
N$77
  Top 0.5: R12.1 20.39,58.75 Q8.B
N$78
  Top 0.5: R11.1 20.14,50.15 Q7.B
N$79
  Top 0.5: R10.1 20.39,41.25 Q6.B
N$80
  Top 0.5: R9.1 20.34,32.75 Q5.B
N$81
  Top 1.676: J10.4 21.11,80 31,80 31,83 39,83 39,77.65 | 39,77.65 39,68.4 35.55,68.4 J7.2 39,68.35 39,59 35.5,59 J6.2 39,59.05 39,50 35.5,50 J5.2 39,49.75 39,40.4 35.5,40.4 J4.2 39,40.45 39,31.2 35.5,31.2 J3.2 39,31.15 39,22 35.5,22 J2.2 39,21.85 39,12.9 38.65,12.55 J1.2 | 39,77.65 J8.2
N$82
  Top 1.676: Q3.E 23.67,13 18,13 18,21.86 | Q10.E 18,72.21 | 18,72.21 18,64 | 18,64 23.83,64 | 24,64 23.83,64 | 23.83,64 Q9.E | Q8.E 18,56.21 | 18,56.21 18,64 | Q7.E 18,47.61 | 18,47.61 18,56.21 | Q6.E 18,38.71 | 18,38.71 18,47.61 | Q5.E 18,30.21 | 18,30.21 18,38.71 | Q4.E 18,21.86 | 18,21.86 18,30.21 | 18,72.21 18,80 18.47,80 J10.3
VCC  (via drill 0.6)  (2 unrouted)
  Top 0.406: Q1.3 108.5,43 115,43 115,36 | 115,36 115,35.58 IC2.4 123.08,35.6 119.5,35.6 119.5,41 133,41 134,39.8 143,39.8 143,41.2 144,41.2 | 96,36 96,14.49 DIS1.2 | 96,36.1 96,36 | 96,36 v106,36 | 115,36 v114,36 114,30 112.06,30 R6.A | 141.1,31.1 R4.1 138.8,31.2 138.8,32.3 130.32,32.3 IC2.20 | C5.2 151,25.65 151,22 153.91,22 IC1.20 156.6,22.14 156.6,25.1 169.4,25.1 169.4,28.5 146.29,28.5 IC1.7 142.85,27.22 C4.2 142.85,28 142.8,28 142.8,31.1 141.1,31.1 | 144,41.2 148.8,41.2 148.8,36 142.2,36 142.2,36.15 LED1.A 141,34.2 LED2.A 141.1,31.1 | X1.9 151.53,59 | 151.53,59 147,59 147,46 144,46 144,41.2 | 151.53,59 151.53,75.6 X2.1 C1.1 163.75,83.75 R16.1
  Bottom 0.406: v106,36 v114,36